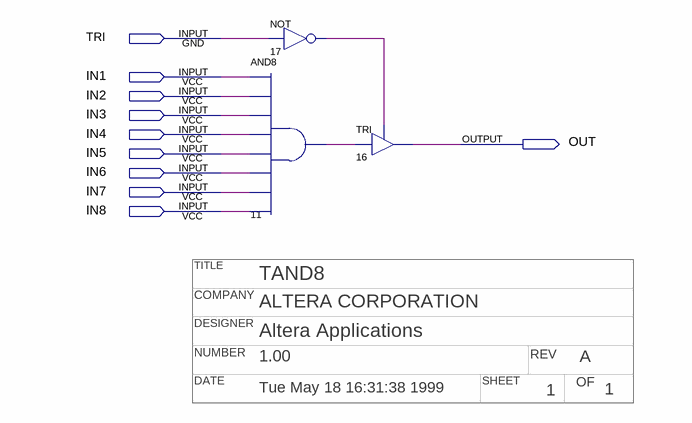
[diagram p0: schematic sheet]
// Quartus schematic tand8.bdf as structural Verilog: 3 symbols, 10 pins
// Title block: TITLE: TAND8; COMPANY: ALTERA CORPORATION; DESIGNER: Altera Applications; NUMBER: 1.00; REV: A; DATE: Tue May 18 16:31:38 1999; SHEET: 1; OF: 1
module tand8 (
  input  TRI,
  input  IN1,
  input  IN2,
  input  IN3,
  input  IN4,
  input  IN5,
  input  IN6,
  input  IN7,
  input  IN8,
  output OUT
);

  wire n11_out, n17_out;

  not u_17 (n17_out, TRI);
  and u_11 (n11_out, IN1, IN2, IN3, IN4, IN5, IN6, IN7, IN8);
  TRI u_16 (.IN(n11_out), .OE(n17_out), .OUT(OUT));
endmodule
